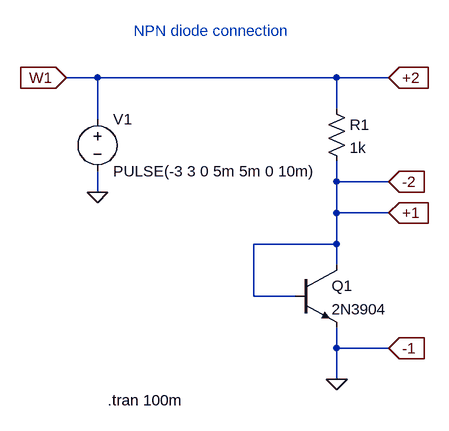
[diagram p0: schematic npn_diode.asc]
npn_diode.asc, the LTspice schematic file:
Version 4
SHEET 1 880 680
WIRE -224 -192 -272 -192
WIRE 144 -192 -224 -192
WIRE 224 -192 144 -192
WIRE 144 -144 144 -192
WIRE -224 -128 -224 -192
WIRE 144 -32 144 -64
WIRE 224 -32 144 -32
WIRE -224 -16 -224 -48
WIRE 144 16 144 -32
WIRE 224 16 144 16
WIRE 144 64 144 16
WIRE 144 64 16 64
WIRE 144 96 144 64
WIRE 16 144 16 64
WIRE 80 144 16 144
WIRE 144 224 144 192
WIRE 224 224 144 224
WIRE 144 272 144 224
FLAG -272 -192 W1
IOPIN -272 -192 In
FLAG 224 -192 +2
IOPIN 224 -192 In
FLAG 224 -32 -2
IOPIN 224 -32 In
FLAG 224 16 +1
IOPIN 224 16 In
FLAG 224 224 -1
IOPIN 224 224 In
FLAG -224 -16 0
FLAG 144 272 0
SYMBOL npn 80 96 R0
SYMATTR InstName Q1
SYMATTR Value 2N3904
SYMBOL res 128 -160 R0
SYMATTR InstName R1
SYMATTR Value 1k
SYMBOL voltage -224 -144 R0
WINDOW 123 0 0 Left 0
WINDOW 39 0 0 Left 0
SYMATTR InstName V1
SYMATTR Value PULSE(-3 3 0 5m 5m 0 10m)
TEXT -208 304 Left 2 !.tran 100m
TEXT -168 -264 Left 2 ;NPN diode connection

The netlist it stands for:
* npn_diode.asc
Q1 +1 +1 0 0 2N3904
R1 +2 +1 1k
V1 +2 0 PULSE(-3 3 0 5m 5m 0 10m)
.model NPN NPN
.model PNP PNP
.lib standard.bjt
.tran 100m
* NPN diode connection
.backanno
.end